# EAGLE schematic Schematic v26 (EAGLE 9.7.0)
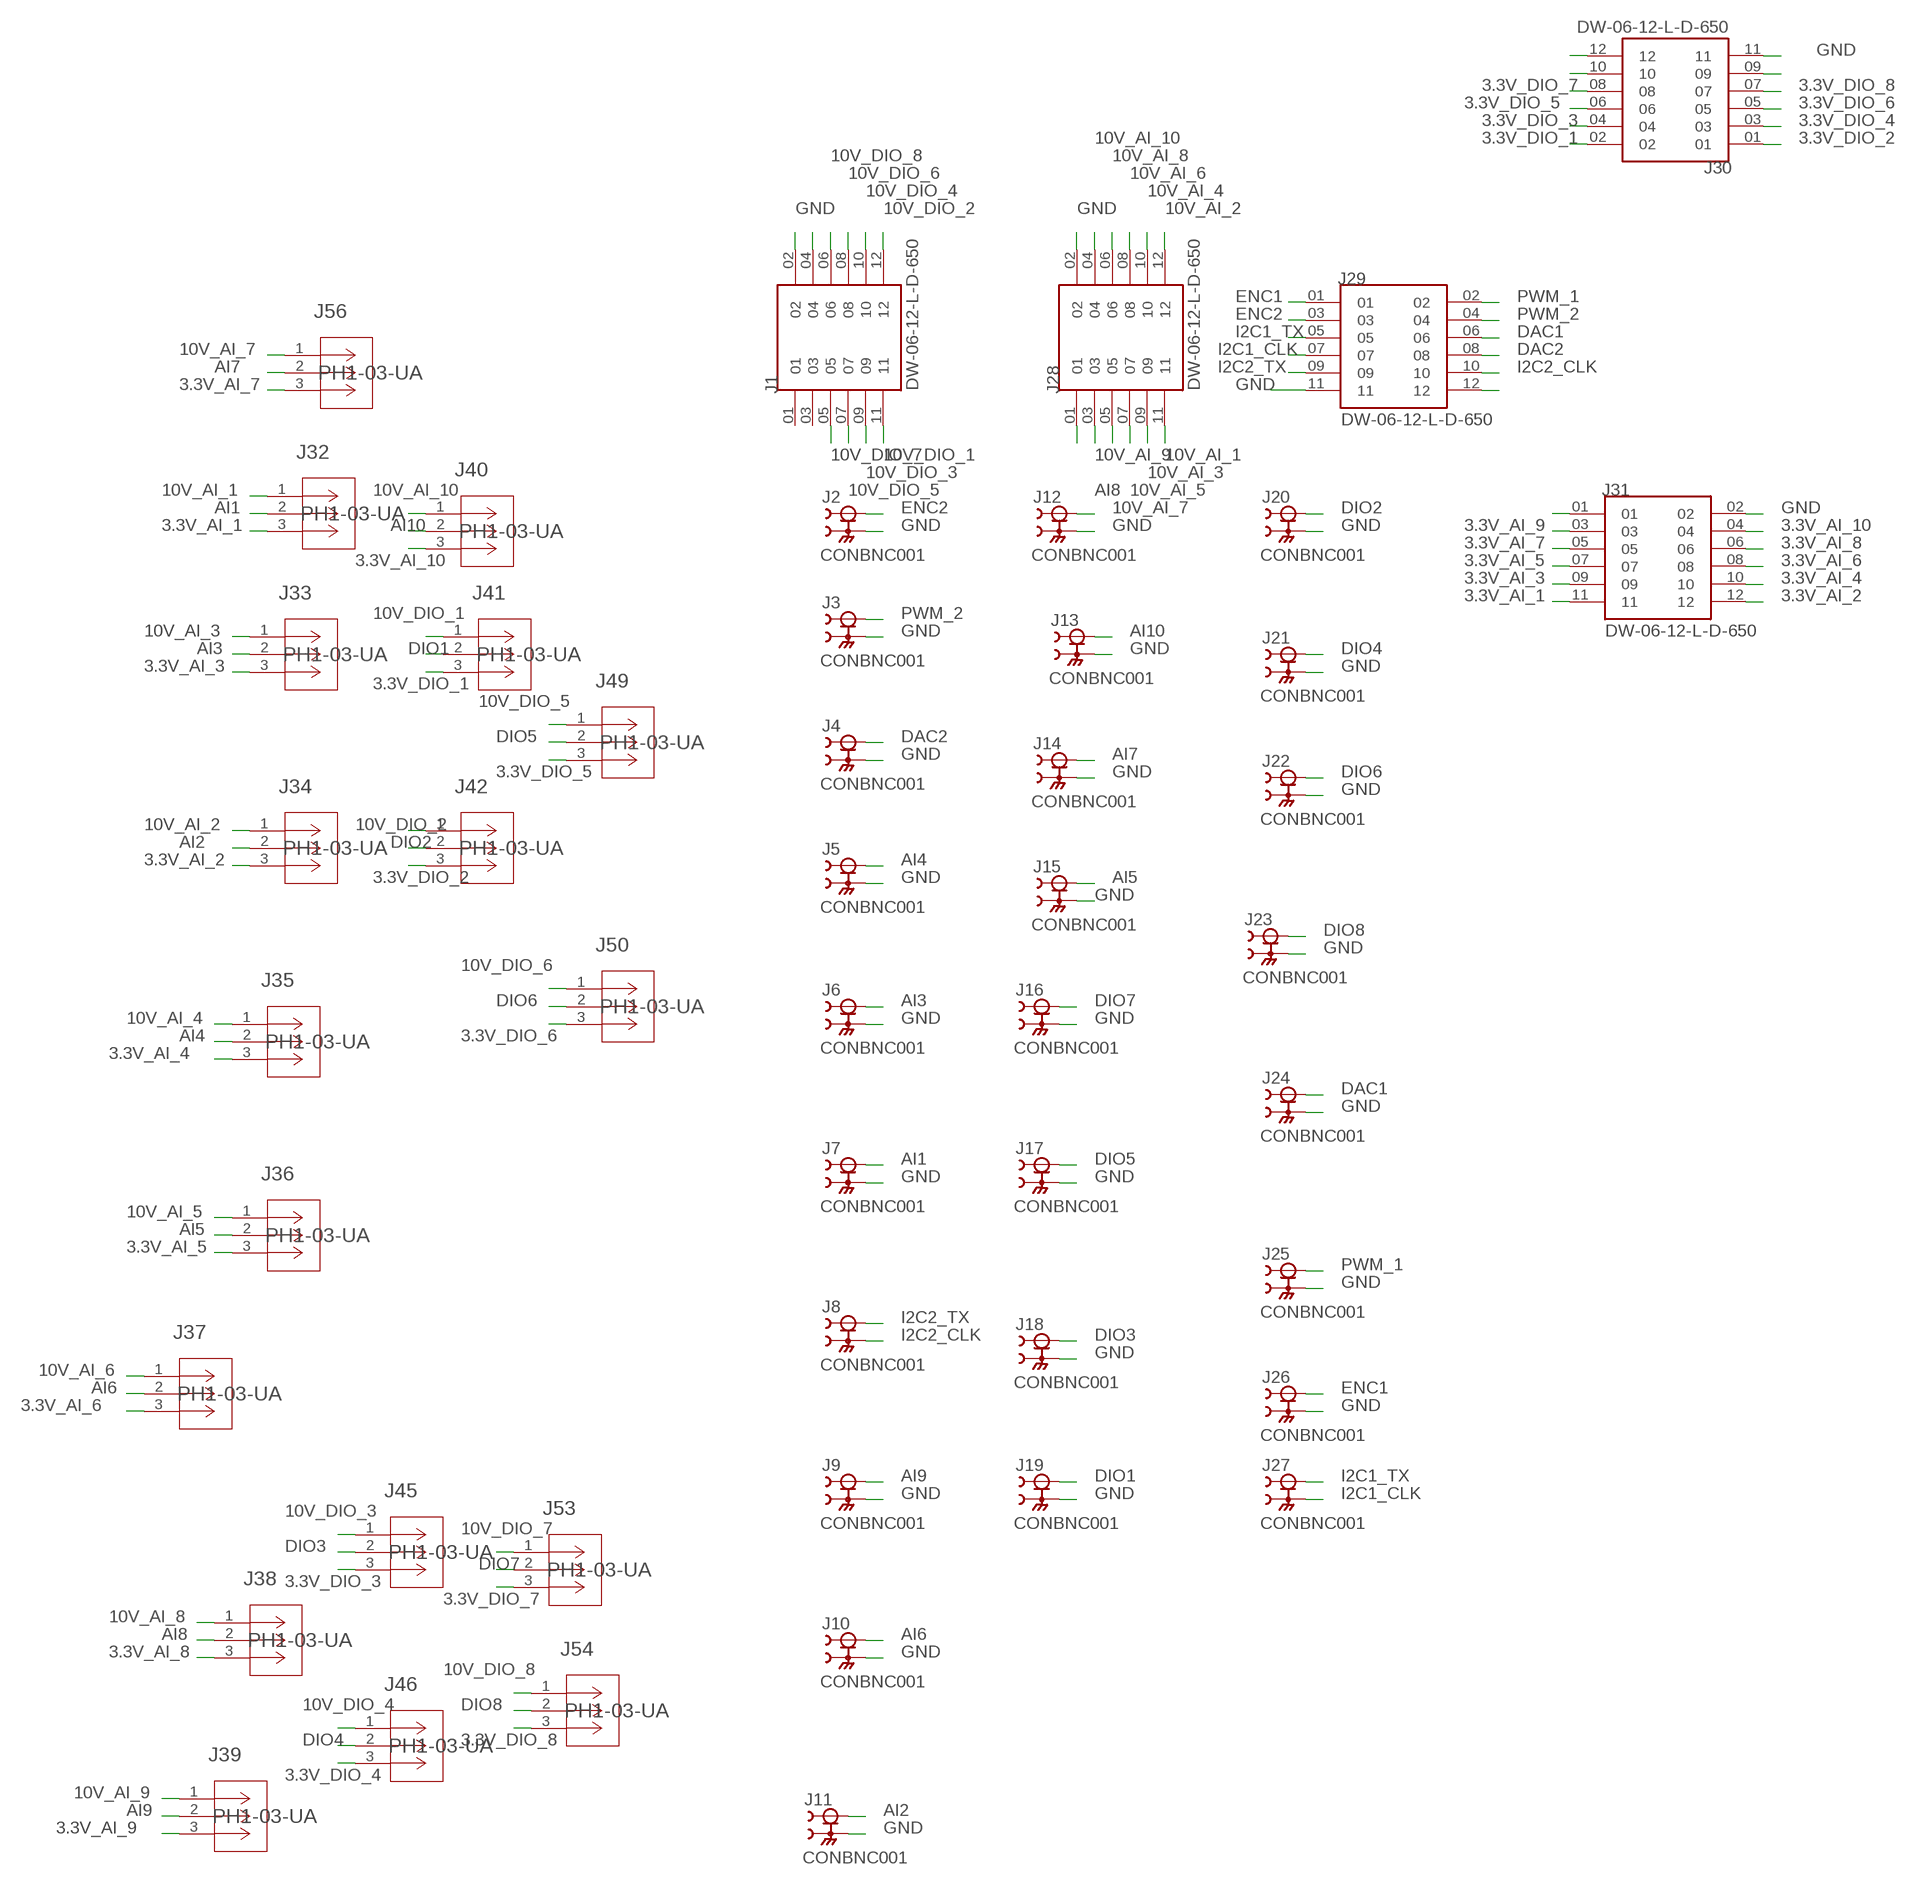
[diagram p0: schematic, sheet 1]

## Parts
J1  DW-06-12-L-D-650  [SAMTEC_DW-06-12-L-D-650]
J2  CONBNC001  [LINX_CONBNC001]
J3  CONBNC001  [LINX_CONBNC001]
J4  CONBNC001  [LINX_CONBNC001]
J5  CONBNC001  [LINX_CONBNC001]
J6  CONBNC001  [LINX_CONBNC001]
J7  CONBNC001  [LINX_CONBNC001]
J8  CONBNC001  [LINX_CONBNC001]
J9  CONBNC001  [LINX_CONBNC001]
J10  CONBNC001  [LINX_CONBNC001]
J11  CONBNC001  [LINX_CONBNC001]
J12  CONBNC001  [LINX_CONBNC001]
J13  CONBNC001  [LINX_CONBNC001]
J14  CONBNC001  [LINX_CONBNC001]
J15  CONBNC001  [LINX_CONBNC001]
J16  CONBNC001  [LINX_CONBNC001]
J17  CONBNC001  [LINX_CONBNC001]
J18  CONBNC001  [LINX_CONBNC001]
J19  CONBNC001  [LINX_CONBNC001]
J20  CONBNC001  [LINX_CONBNC001]
J21  CONBNC001  [LINX_CONBNC001]
J22  CONBNC001  [LINX_CONBNC001]
J23  CONBNC001  [LINX_CONBNC001]
J24  CONBNC001  [LINX_CONBNC001]
J25  CONBNC001  [LINX_CONBNC001]
J26  CONBNC001  [LINX_CONBNC001]
J27  CONBNC001  [LINX_CONBNC001]
J28  DW-06-12-L-D-650  [SAMTEC_DW-06-12-L-D-650]
J29  DW-06-12-L-D-650  [SAMTEC_DW-06-12-L-D-650]
J30  DW-06-12-L-D-650  [SAMTEC_DW-06-12-L-D-650]
J31  DW-06-12-L-D-650  [SAMTEC_DW-06-12-L-D-650]
J32  PH1-03-UA  [CONN_PH1-03-UA_ADM]
J33  PH1-03-UA  [CONN_PH1-03-UA_ADM]
J34  PH1-03-UA  [CONN_PH1-03-UA_ADM]
J35  PH1-03-UA  [CONN_PH1-03-UA_ADM]
J36  PH1-03-UA  [CONN_PH1-03-UA_ADM]
J37  PH1-03-UA  [CONN_PH1-03-UA_ADM]
J38  PH1-03-UA  [CONN_PH1-03-UA_ADM]
J39  PH1-03-UA  [CONN_PH1-03-UA_ADM]
J40  PH1-03-UA  [CONN_PH1-03-UA_ADM]
J41  PH1-03-UA  [CONN_PH1-03-UA_ADM]
J42  PH1-03-UA  [CONN_PH1-03-UA_ADM]
J45  PH1-03-UA  [CONN_PH1-03-UA_ADM]
J46  PH1-03-UA  [CONN_PH1-03-UA_ADM]
J49  PH1-03-UA  [CONN_PH1-03-UA_ADM]
J50  PH1-03-UA  [CONN_PH1-03-UA_ADM]
J53  PH1-03-UA  [CONN_PH1-03-UA_ADM]
J54  PH1-03-UA  [CONN_PH1-03-UA_ADM]
J56  PH1-03-UA  [CONN_PH1-03-UA_ADM]

## Nets
3.3V_AI_1: J31.11 J32.3
3.3V_AI_2: J31.12 J34.3
3.3V_AI_3: J31.09 J33.3
3.3V_AI_4: J31.10 J35.3
3.3V_AI_5: J31.07 J36.3
3.3V_AI_6: J31.08 J37.3
3.3V_AI_7: J31.05 J56.3
3.3V_AI_8: J31.06 J38.3
3.3V_AI_9: J31.03 J39.3
3.3V_AI_10: J31.04 J40.3
3.3V_DIO_1: J30.02 J41.3
3.3V_DIO_2: J30.01 J42.3
3.3V_DIO_3: J30.04 J45.3
3.3V_DIO_4: J30.03 J46.3
3.3V_DIO_5: J30.06 J49.3
3.3V_DIO_6: J30.05 J50.3
3.3V_DIO_7: J30.08 J53.3
3.3V_DIO_8: J30.07 J54.3
10V_AI_1: J28.11 J32.1
10V_AI_2: J28.12 J34.1
10V_AI_3: J28.09 J33.1
10V_AI_4: J28.10 J35.1
10V_AI_5: J28.07 J36.1
10V_AI_6: J28.08 J37.1
10V_AI_7: J28.05 J56.1
10V_AI_8: J28.06 J38.1
10V_AI_9: J28.03 J39.1
10V_AI_10: J28.04 J40.1
10V_DIO_1: J1.11 J41.1
10V_DIO_2: J1.12 J42.1
10V_DIO_3: J1.09 J45.1
10V_DIO_4: J1.10 J46.1
10V_DIO_5: J1.07 J49.1
10V_DIO_6: J1.08 J50.1
10V_DIO_7: J1.05 J53.1
10V_DIO_8: J1.06 J54.1
AI1: J7.1 J32.2
AI2: J11.1 J34.2
AI3: J6.1 J33.2
AI4: J5.1 J35.2
AI5: J15.1 J36.2
AI6: J10.1 J37.2
AI7: J14.1 J56.2
AI8: J12.1 J38.2
AI9: J9.1 J39.2
AI10: J13.1 J40.2
DAC1: J24.1 J29.06
DAC2: J4.1 J29.08
DIO1: J19.1 J41.2
DIO2: J20.1 J42.2
DIO3: J18.1 J45.2
DIO4: J21.1 J46.2
DIO5: J17.1 J49.2
DIO6: J22.1 J50.2
DIO7: J16.1 J53.2
DIO8: J23.1 J54.2
ENC1: J26.1 J29.01
ENC2: J2.1 J29.03
GND: J1.02 J2.S1 J2.S2 J2.S3 J2.S4 J3.S1 J3.S2 J3.S3 J3.S4 J4.S1 J4.S2 J4.S3 J4.S4 J5.S1 J5.S2 J5.S3 J5.S4 J6.S1 J6.S2 J6.S3 J6.S4 J7.S1 J7.S2 J7.S3 J7.S4 J9.S1 J9.S2 J9.S3 J9.S4 J10.S1 J10.S2 J10.S3 J10.S4 J11.S1 J11.S2 J11.S3 J11.S4 J12.S1 J12.S2 J12.S3 J12.S4 J13.S1 J13.S2 J13.S3 J13.S4 J14.S1 J14.S2 J14.S3 J14.S4 J15.S1 J15.S2 J15.S3 J15.S4 J16.S1 J16.S2 J16.S3 J16.S4 J17.S1 J17.S2 J17.S3 J17.S4 J18.S1 J18.S2 J18.S3 J18.S4 J19.S1 J19.S2 J19.S3 J19.S4 J20.S1 J20.S2 J20.S3 J20.S4 J21.S1 J21.S2 J21.S3 J21.S4 J22.S1 J22.S2 J22.S3 J22.S4 J23.S1 J23.S2 J23.S3 J23.S4 J24.S1 J24.S2 J24.S3 J24.S4 J25.S1 J25.S2 J25.S3 J25.S4 J26.S1 J26.S2 J26.S3 J26.S4 J28.02 J29.11 J30.11 J31.02
I2C1_CLK: J27.S1 J27.S2 J27.S3 J27.S4 J29.07
I2C1_TX: J27.1 J29.05
I2C2_CLK: J8.S1 J8.S2 J8.S3 J8.S4 J29.10
I2C2_TX: J8.1 J29.09
N$15: J1.04
N$20: J28.01
N$43: J29.12
N$48: J30.09
N$54: J30.10
N$55: J30.12
N$56: J31.01
PWM_1: J25.1 J29.02
PWM_2: J3.1 J29.04
Unconnected: J1.01 J1.03

## Library data of the parts
J1 J28-J31 = DW-06-12-L-D-650:DW-06-12-L-D-650; MANUFACTURER: Samtec; PARTREV: R; STANDARD: Manufacturer Recommendations
J2-J27 = CONBNC001:CONBNC001: Check availability <https://pricing.snapeda.com/parts/CONBNC001/Linx%20Technologies%20Inc./view-part?ref=eda>; AVAILABILITY: In Stock; CHECK_PRICES: https://www.snapeda.com/parts/CONBNC001/Linx/view-part/?ref=eda; DESCRIPTION: BNC Jack 50 Ohm PCB Through Hole; MF: Linx Technologies Inc.; MP: CONBNC001; PACKAGE: None; PRICE: None; PURCHASE-URL: https://www.snapeda.com/api/url_track_click_mouser/?unipart_id=12122496&manufacturer=Linx Technologies Inc.&part_name=CONBNC001&search_term=None; SNAPEDA_LINK: https://www.snapeda.com/parts/CONBNC001/Linx/view-part/?ref=snap
J32-J42 J45 J46 J49 J50 J53 J54 J56 = Pin Headers:PH1-03-UA; COPYRIGHT: Copyright (C) 2025 Ultra Librarian. All rights reserved.; DIGIKEY_PART_NUMBER_1: 2057-PH1-03-UA-ND; MANUFACTURER_PART_NUMBER: PH1-03-UA; MFR_NAME: ADAM TECHNOLOGIES INC